# Altium schematic sheet CM4.SchDoc
size A4; SheetNumber: 3; SheetTotal: 8
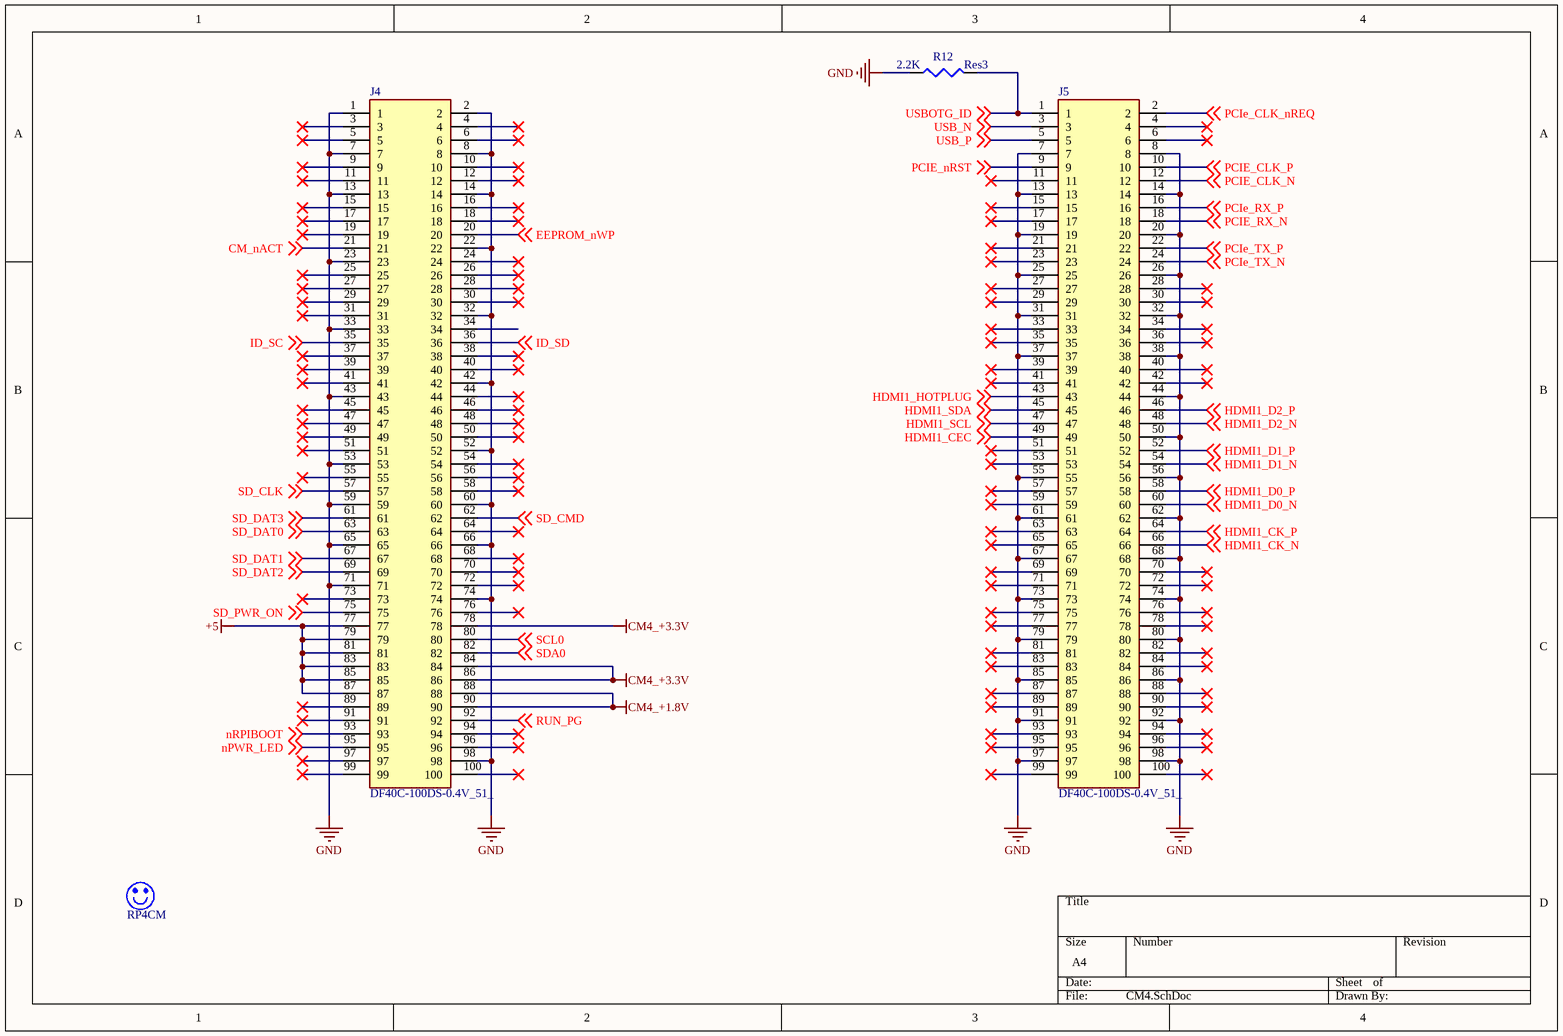
[diagram p0: CM4.SchDoc]

## Parts
J4  DF40C-100DS-0.4V_51_  [DF40C100DS04V51]
J5  DF40C-100DS-0.4V_51_  [DF40C100DS04V51]
M?  RP4CM  [RP4CM0]  (mechanical)
R12  Res3  value 2.2K  [J1-0603]

## Nets
+5: J4.77 J4.79 J4.81 J4.83 J4.85 J4.87
CM4_+1.8V: J4.88 J4.90
CM4_+3.3V: J4.78 J4.84 J4.86
GND: J4.1 J4.2 J4.7 J4.8 J4.13 J4.14 J4.22 J4.23 J4.32 J4.33 J4.42 J4.43 J4.52 J4.53 J4.59 J4.60 J4.65 J4.66 J4.71 J4.74 J4.98 J5.7 J5.8 J5.13 J5.14 J5.19 J5.20 J5.25 J5.26 J5.31 J5.32 J5.37 J5.38 J5.44 J5.50 J5.55 J5.56 J5.61 J5.62 J5.67 J5.68 J5.73 J5.74 J5.79 J5.80 J5.85 J5.86 J5.91 J5.92 J5.97 J5.98 R12.1
CM_nACT: J4.21 ; off-sheet CM_nACT
EEPROM_nWP: J4.20 ; off-sheet EEPROM_nWP
HDMI1_CEC: J5.49 ; off-sheet HDMI1_CEC
HDMI1_CK_N: J5.66 ; off-sheet HDMI1_CK_N
HDMI1_CK_P: J5.64 ; off-sheet HDMI1_CK_P
HDMI1_D0_N: J5.60 ; off-sheet HDMI1_D0_N
HDMI1_D0_P: J5.58 ; off-sheet HDMI1_D0_P
HDMI1_D1_N: J5.54 ; off-sheet HDMI1_D1_N
HDMI1_D1_P: J5.52 ; off-sheet HDMI1_D1_P
HDMI1_D2_N: J5.48 ; off-sheet HDMI1_D2_N
HDMI1_D2_P: J5.46 ; off-sheet HDMI1_D2_P
HDMI1_HOTPLUG: J5.43 ; off-sheet HDMI1_HOTPLUG
HDMI1_SCL: J5.47 ; off-sheet HDMI1_SCL
HDMI1_SDA: J5.45 ; off-sheet HDMI1_SDA
ID_SC: J4.35 ; off-sheet ID_SC
ID_SD: J4.36 ; off-sheet ID_SD
nPWR_LED: J4.95 ; off-sheet nPWR_LED
nRPIBOOT: J4.93 ; off-sheet nRPIBOOT
PCIE_CLK_N: J5.12 ; off-sheet PCIE_CLK_N
PCIe_CLK_nREQ: J5.2 ; off-sheet PCIe_CLK_nREQ
PCIE_CLK_P: J5.10 ; off-sheet PCIE_CLK_P
PCIE_nRST: J5.9 ; off-sheet PCIE_nRST
PCIE_RX_N: J5.18 ; off-sheet PCIE_RX_N
PCIe_RX_P: J5.16 ; off-sheet PCIe_RX_P
PCIe_TX_N: J5.24 ; off-sheet PCIe_TX_N
PCIe_TX_P: J5.22 ; off-sheet PCIe_TX_P
RUN_PG: J4.92 ; off-sheet RUN_PG
SCL0: J4.80 ; off-sheet SCL0
SD_CLK: J4.57 ; off-sheet SD_CLK
SD_CMD: J4.62 ; off-sheet SD_CMD
SD_DAT0: J4.63 ; off-sheet SD_DAT0
SD_DAT1: J4.67 ; off-sheet SD_DAT1
SD_DAT2: J4.69 ; off-sheet SD_DAT2
SD_DAT3: J4.61 ; off-sheet SD_DAT3
SD_PWR_ON: J4.75 ; off-sheet SD_PWR_ON
SDA0: J4.82 ; off-sheet SDA0
USB_N: J5.3 ; off-sheet USB_N
USB_P: J5.5 ; off-sheet USB_P
USBOTG_ID: J5.1 R12.2 ; off-sheet USBOTG_ID

Not connected (* = marked no-connect by the designer): J4 3* 4* 5* 6* 9* 10* 11* 12* 15* 16* 17* 18* 19* 24* 25* 26* 27* 28* 29* 30* 31* 34 37* 38* 39* 40* 41* 44* 45* 46* 47* 48* 49* 50* 51* 54* 55* 56* 58* 64* 68* 70* 72* 73* 76* 89* 91* 94* 96* 97* 99* 100*; J5 4* 6* 11* 15* 17* 21* 23* 27* 28* 29* 30* 33* 34* 35* 36* 39* 40* 41* 42* 51* 53* 57* 59* 63* 65* 69* 70* 71* 72* 75* 76* 77* 78* 81* 82* 83* 84* 87* 88* 89* 90* 93* 94* 95* 96* 99* 100*

## Library data of the parts
J4 J5 = DF40C-100DS-0.4V_51_: Connector; Manufacturer_Name: Hirose; Manufacturer_Part_Number: DF40C-100DS-0.4V(51); Datasheet Link: https://www.hirose.com/product/en/download_file/key_name/DF40C-100DS-0.4V%2851%29/category/Drawing%20(2D)/doc_file_id/46856/?file_category_id=6&item_id=06844033451&is_series=; Height: 1.65mm; Mouser Part Number: 798-DF40C100DS0.4V51; Mouser Price/Stock: https://www.mouser.co.uk/ProductDetail/Hirose-Connector/DF40C-100DS-04V51?qs=eDUdFcBPps2MEwbnuPvZzQ%3D%3D; Arrow Part Number: DF40C-100DS-0.4V(51); Arrow Price/Stock: https://www.arrow.com/en/products/df40c-100ds-0.4v-51/hirose-electric
M? = RP4CM: Raspberry Pi  Computed Module 4
R12 = Res3: Resistor; Published: 8-Jun-2000; LatestRevisionDate: 29-May-2009; LatestRevisionNote: IPC-7351 Footprint Added.; PackageReference: J1-0603; Publisher: Altium Limited; PackageDescription: Chip Resistor